# Altium project eTraceConcrete_V1_1.PrjPcb (part 5 of 7)

## Sheet RTC.SchDoc
size A4
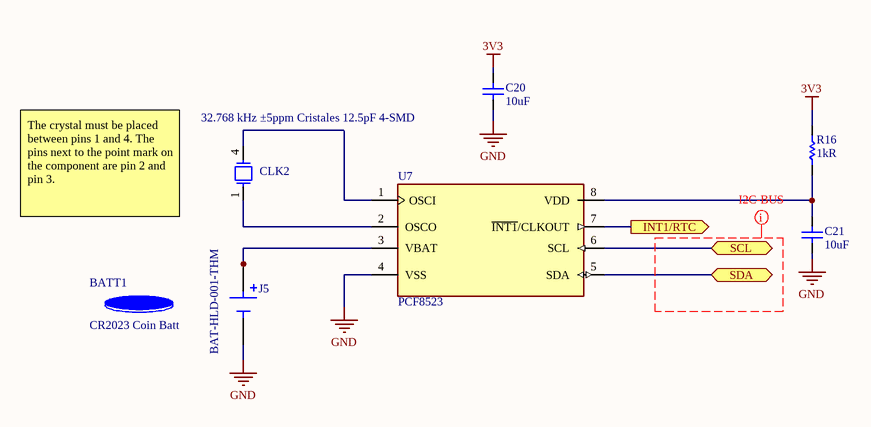
[diagram p6: RTC.SchDoc]

### Parts
BATT1  CR2023 Coin Batt  [CR2032 BATT]
C20  10uF  [Cap 0805 (2012 Metric)]
C21  10uF  [Cap 0805 (2012 Metric)]
CLK2  32.768 kHz ±5ppm Cristales 12.5pF 4-SMD  [Crystal32768]
J5  BAT-HLD-001-THM  [BAT-HLD-001-THM]
R16  1kR  [Res 0805 (2012 Metric)]
U7  PCF8523  [PCF8523]

### Ports
INT1/RTC (out), SCL (bidir), SDA (bidir)

### Nets
3V3: C20.1 R16.1
GND: C20.2 C21.2 J5.N U7.4(VSS)  [project net BS]
SCL: U7.6(SCL) ; port SCL
SDA: U7.5(SDA) ; port SDA
NetC21_1: C21.1 R16.2 U7.8(VDD)
NetCLK2_1: CLK2.1 U7.2(OSCO)
NetCLK2_4: CLK2.4 U7.1(OSCI)
NetJ5_P1: J5.P1(P) J5.P2(P) J5.P3(P) J5.P4(P) U7.3(VBAT)
NetU7_7: U7.7(~{INT1}/CLKOUT) ; port INT1/RTC

### Layout directives
net class I2C-BUS: (no net found under the mark)

### Notes on the sheet
- The crystal must be placed between pins 1 and 4. The pins next to the point mark on the component are pin 2 and pin 3.

### Library data of the parts
BATT1 = CR2023 Coin Batt: CR2032 Series Ø 20 mm 3V 225mAh Non-Rechargeable Lithium Coin Cell Battery; Manufacturer: Panasonic BSG; Number of Cells: 1; Battery Size: 2032; Battery Type: PRIMARY; Supplier 1: Mouser; RoHS: Yes; Category: Passive Components; Mount: External; Weight: 0.1oz; Material: Lithium; Min Operating Temperature: -30°C; Max Operating Temperature: 60°C; Package Quantity: 200; Capacity: 225mAh; Packaging: Tray; Series: CR2032; Chemistry/Technology: Lithium; Voltage Rating: 3V; Battery Chemistry: LITHIUM; Output Voltage: 3V; Voltage: 3V; Voltage Rating (DC): 3V; Diameter: 20mm; Height: 0.13inch; Radiation Hardening: No; Lead Free: Lead Free; RoHS Compliant: Yes; ComponentLink1URL: https://datasheet.ciiva.com/2/crseries-datasheets-merged-2903.pdf?src-supplier=Digi-Key; ComponentLink1Description: https://datasheet.ciiva.com/2/crseries-datasheets-merged-2903.pdf?src-supplier=Digi-Key; ComponentLink2URL: https://datasheet.ciiva.com/2981/aaa4000ce51-2981326.pdf?src-supplier=Avnet; ComponentLink2Description: https://datasheet.ciiva.com/2981/aaa4000ce51-2981326.pdf?src-supplier=Avnet; ComponentLink3URL: https://datasheet.ciiva.com/12070/crseries-datasheets-merged-462862-12070381.pdf?src-supplier=Mouser; ComponentLink3Description: https://datasheet.ciiva.com/12070/crseries-datasheets-merged-462862-12070381.pdf?src-supplier=Mouser; ComponentLink4URL: https://datasheet.ciiva.com/16459/aaa4000ce51-16459422.pdf?src-supplier=Avnet+Asia; ComponentLink4Description: https://datasheet.ciiva.com/16459/aaa4000ce51-16459422.pdf?src-supplier=Avnet+Asia; Pricing 1: 1=0,34000, 10=0,28100, 50=0,28100, 100=0,21700, 1000=0,19500, 10000=0,18100 (USD); Supplier Part Number 1: 658-CR2032; Manufacturer Part Number: CR2032; Link: https://www.digikey.com/es/products/detail/maxell-batteries/MAXELL-CR2032-TS-1/13283094
C20 C21 = Capacitor: CAP CER 10UF 10V X5R 0805; Manufacturer: KEMET; Manufacturer Part Number: C0805C106K8PACTU; Dielectric Material: Ceramic; Tolerance: 10%; Link: https://www.digikey.com/es/products/detail/kemet/C0805C106K8PACTU/1090830?s=N4IgTCBcDaIMIAYAcCCscCMCBsBpJACgIJwAqAqiALoC%2BQA; Supplier 1: Digi-Key; Supplier Part Number 1: 399-4925-1-ND; RoHS: Yes; Category: Ceramic Capacitors; Stock 1: 1166327; Pricing 1: 1=0,15000, 10=0,10600, 50=0,06040, 100=0,05000, 500=0,03508, 1000=0,02904 (USD); Mount: Surface Mount; Case/Package: 0805; Number of Pins: 2; Case Code (Imperial): 0805; Case Code (Metric): 2012; Contact Plating: Tin,Matte; Min Operating Temperature: -55°C; Max Operating Temperature: 85°C; Capacitance: 10uF; Packaging: Tape and Reel; Voltage Rating (DC): 10V; Termination: SMD/SMT; Package Quantity: 1; Voltage Rating: 10V; Voltage: 10V; Series: C; Dielectric: X5R; Construction: Flat; Dissipation Factor: 10%; Length: 2mm; Width: 1.2mm; Height: 1.25mm; Depth: 1.25mm; Thickness: 0.055inch; Radiation Hardening: No; REACH SVHC: No SVHC; RoHS Compliant: Yes; ComponentLink1URL: https://datasheet.ciiva.com/7842/1732709-7842198.pdf?src-supplier=Element14; ComponentLink1Description: https://datasheet.ciiva.com/7842/1732709-7842198.pdf?src-supplier=Element14; ComponentLink2URL: https://datasheet.ciiva.com/7842/40889-7842552.pdf?src-supplier=Element14; ComponentLink2Description: https://datasheet.ciiva.com/7842/40889-7842552.pdf?src-supplier=Element14; ComponentLink3URL: https://datasheet.ciiva.com/22704/1732709-22704859.pdf?src-supplier=Element14; ComponentLink3Description: https://datasheet.ciiva.com/22704/1732709-22704859.pdf?src-supplier=Element14
CLK2 = Crystal32768: 8.0x3.8 - 32.768KHz Quartz Xtal / Plastic, +/-5ppm @25C, 12.5pF; Manufacturer: QST; Manufacturer Part Number: QT2M-32.768KHZF-T; Supplier 1: Future Electronics; RoHS: No; Category: Uncategorized; Supplier Part Number 1: 9124852; Pricing 1: 3000=0,39500, 6000=0,31500 (USD); Link: https://www.digikey.com/es/products/detail/qst/QT2M-32-768KHZF-T/13418370
J5 = BAT-HLD-001-THM: BATTERY RETAINER COIN PC PIN; Manufacturer: Linx; Number of Cells: 1; Supplier 1: Digi-Key; RoHS: Yes; Category: Uncategorized; Stock 1: 22994; Mount: Through Hole,PCB; Package Quantity: 1000; Termination: PC Pin; Series: -; Packaging: Bulk; Lead Free: Lead Free; ComponentLink1URL: https://datasheet.ciiva.com/4/bat-hld-001-thm-4036.pdf?src-supplier=Digi-Key; ComponentLink1Description: https://datasheet.ciiva.com/4/bat-hld-001-thm-4036.pdf?src-supplier=Digi-Key; ComponentLink2URL: https://datasheet.ciiva.com/4642/bat-hld-001-thm20diagram-201675-4642582.pdf?src-supplier=Mouser; ComponentLink2Description: https://datasheet.ciiva.com/4642/bat-hld-001-thm20diagram-201675-4642582.pdf?src-supplier=Mouser; Pricing 1: 1=0,29000, 10=0,27800, 25=0,26600, 100=0,24100, 250=0,23200, 500=0,22200, 1000=0,20300, 2000=0,19000, 5000=0,17600 (USD); Manufacturer Part Number: BAT-HLD-001-THM; Supplier Part Number 1: BAT-HLD-001-THM-ND; Link: https://www.digikey.com/es/products/detail/linx-technologies-inc/BAT-HLD-001-THM/3044009?s=N4IgTCBcDaIEIEEAqBaAEgGQCIoAy4EYUk0BZEAXQF8g
R16 = Resistor: RES 1K OHM 1% 1/4W 0805; Manufacturer: Stackpole Electronics; Manufacturer Part Number: RNCP0805FTD1K00; Power Rating: 250mW; Temperature Coefficient: 100ppm/°C; Link: https://www.digikey.com/es/products/detail/stackpole-electronics-inc/RNCP0805FTD1K00/2240229?s=N4IgTCBcDaIEoDkDCAFADADjQVgGIBUARARgGk00QBdAXyA; Supplier 1: Digi-Key; Supplier Part Number 1: RNCP0805FTD1K00CT-ND; RoHS: Yes; Category: Chip SMD Resistors; Stock 1: 316834; Pricing 1: 1=0,10000, 10=0,07000, 100=0,02830, 1000=0,01272, 2500=0,01104 (USD); Mount: Surface Mount; Case/Package: 0805; Case Code (Metric): 2012; Case Code (Imperial): 0805; Size Code: 0805; Min Operating Temperature: -55°C; Max Operating Temperature: 155°C; Tolerance: 1%; Resistance: 1kR; Packaging: Tape and Reel; Resistor Type: Thin Film; Number of Terminations: 2; Max Power Dissipation: 250mW; Features: Moisture Resistant,Anti-Sulfur; Series: RNCP; Length: 0.079inch; Width: 0.049inch; Height: 0.024inch; Lead Free: Lead Free; RoHS Compliant: Yes; ComponentLink1URL: https://www.seielect.com/catalog/SEI-Packaging.pdf?src-supplier=Digi-Key; ComponentLink1Description: https://www.seielect.com/catalog/SEI-Packaging.pdf?src-supplier=Digi-Key; ComponentLink2URL: https://www.seielect.com/Catalog/SEI-rncp.pdf?src-supplier=Digi-Key; ComponentLink2Description: https://www.seielect.com/Catalog/SEI-rncp.pdf?src-supplier=Digi-Key; ComponentLink3URL: http://www.seielect.com/Catalog/SEI-rncp.pdf?src-supplier=Future+Electronics; ComponentLink3Description: http://www.seielect.com/Catalog/SEI-rncp.pdf?src-supplier=Future+Electronics
U7 = PCF8523: IC RTC CLK/CALENDAR I2C 8-SOIC; Manufacturer: NXP Semiconductors; Manufacturer Part Number: PCF8523T/1,118; Time Format: HH:MM:SS; Logic Function: Clock; Min Supply Voltage: 1.2V; Max Supply Voltage: 5.5V; Supplier 1: Avnet; RoHS: Yes; Category: Interface ICs; Mount: Surface Mount; Case/Package: SO; Number of Pins: 8; Contact Plating: Gold; Min Operating Temperature: -40°C; Max Operating Temperature: 85°C; Packaging: Tape and Reel; Interface: I2C; Package Quantity: 2500; Supply Voltage-Nom: 5.5V; Radiation Hardening: No; RoHS Compliant: Yes; REACH SVHC: No SVHC; Lead Free: Lead Free; Temperature Grade: INDUSTRIAL; ComponentLink1URL: https://datasheet.ciiva.com/1238/pcf8523-1238780.pdf?src-supplier=Digi-Key; ComponentLink1Description: https://datasheet.ciiva.com/1238/pcf8523-1238780.pdf?src-supplier=Digi-Key; ComponentLink2URL: https://datasheet.ciiva.com/1238/pcf8523-1238781.pdf?src-supplier=Digi-Key; ComponentLink2Description: https://datasheet.ciiva.com/1238/pcf8523-1238781.pdf?src-supplier=Digi-Key; ComponentLink3URL: https://datasheet.ciiva.com/1238/pcf8523-1238782.pdf?src-supplier=Digi-Key; ComponentLink3Description: https://datasheet.ciiva.com/1238/pcf8523-1238782.pdf?src-supplier=Digi-Key; ComponentLink4URL: https://datasheet.ciiva.com/15152/getdatasheetpartid-445247-15152839.pdf?src-supplier=Verical; ComponentLink4Description: https://datasheet.ciiva.com/15152/getdatasheetpartid-445247-15152839.pdf?src-supplier=Verical; ComponentLink5URL: https://datasheet.ciiva.com/16286/pcf8523-16286477.pdf?src-supplier=Future+Electronics; ComponentLink5Description: https://datasheet.ciiva.com/16286/pcf8523-16286477.pdf?src-supplier=Future+Electronics; Supplier Part Number 1: 52X6196; Pricing 1: 1=1,58000, 10=1,41000, 25=1,34000, 50=1,22000, 100=1,10000, 250=1,03000 (USD); Link: https://www.digikey.com/es/products/detail/nxp-usa-inc/PCF8523T-1-118/2530422

## Sheet SD.SchDoc
size A4
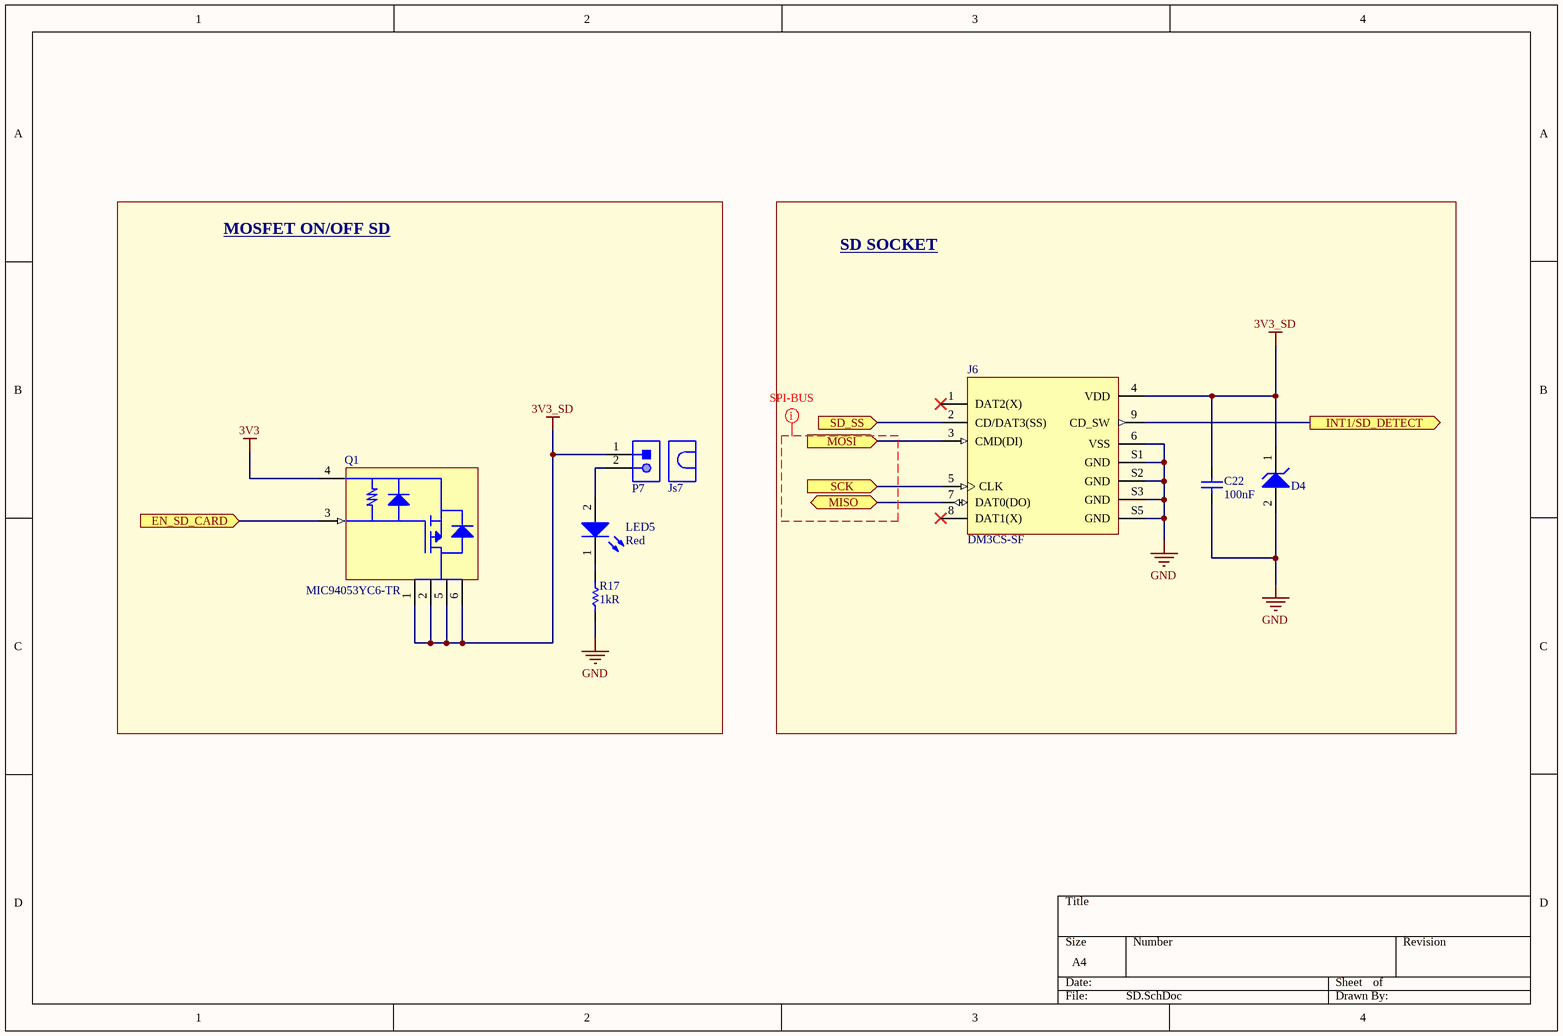
[diagram p7: SD.SchDoc]

### Parts
C22  100nF  [Cap 0805 (2012 Metric)]
D4  Diode  [Diode SOD123]  (value not drawn)
J6  DM3CS-SF  [SDHolder]
Js7  Jumper (2x1)  [Header JMP 2x1]  (value not drawn)
LED5  Red  [LED 0805(2012 METRIC)]
P7  Header 2x1  [Header 2x1]  (value not drawn)
Q1  MIC94053YC6-TR  [SC-70-6]
R17  1kR  [Res 0805 (2012 Metric)]

### Blocks framed on the sheet
MOSFET ON/OFF SD: Js7 LED5 P7 Q1 R17
SD SOCKET: C22 D4 J6

### Ports
EN_SD_CARD (in), INT1/SD_DETECT (out), MISO (bidir), MOSI (in), SCK (in), SD_SS (in)

### Nets
3V3: Q1.4(S)
3V3_SD: C22.1 D4.1(K) J6.4(VDD) P7.1 Q1.1(D) Q1.2(D) Q1.5(D) Q1.6(D)
GND: C22.2 D4.2(A) J6.6(VSS) J6.S1(GND) J6.S2(GND) J6.S3(GND) J6.S5(GND) R17.2  [project net BS]
EN_SD_CARD: Q1.3(G) ; port EN_SD_CARD
INT1/SD_DETECT: J6.9(CD_SW) ; port INT1/SD_DETECT
MISO: J6.7(DAT0(DO)) ; port MISO
MOSI: J6.3(CMD(DI)) ; port MOSI
SCK: J6.5(CLK) ; port SCK
SD_SS: J6.2(CD/DAT3(SS)) ; port SD_SS
NetLED5_1: LED5.1(K) R17.1
NetLED5_2: LED5.2(A) P7.2

Not connected (* = marked no-connect by the designer): J6 1(DAT2(X))* 8(DAT1(X))*

### Layout directives
net class SPI-BUS: (no net found under the mark)

### Library data of the parts
C22 = Capacitor: YAGEO (PHYCOMP)         CC0805ZRY5V9BB104             SMD Multilayer Ceramic Capacitor, 0805 [2012 Metric], 0.1 uF, 50 V, +80%, -20%, Y5V, CC Series; Tolerance: 80%; Voltage Rating: 50V; Link: https://www.digikey.com/es/products/detail/yageo/CC0805ZRY5V9BB104/2103099?s=N4IgTCBcDaIMJwAwA5EFYBaAlAmmgagJwBCxAjIgCwgC6AvkA; Supplier 1: Digi-Key; Supplier Part Number 1: 311-1361-1-ND; Manufacturer: Yageo; Manufacturer Part Number: CC0805ZRY5V9BB104; RoHS: Yes; Category: Ceramic Capacitors; Stock 1: 92689; Pricing 1: 1=0,10000, 10=0,07000, 50=0,03800, 100=0,03100, 500=0,02214, 1000=0,01739 (USD); Mount: Surface Mount; Case/Package: 0805; Number of Pins: 2; Case Code (Metric): 2012; Case Code (Imperial): 0805; Material: Ceramic; Dielectric Material: Ceramic; Min Operating Temperature: -30°C; Max Operating Temperature: 85°C; Capacitance: 100nF; Dielectric: Y5V; Package Quantity: 1; Packaging: Tape and Reel; Voltage Rating (DC): 50V; Termination: SMD/SMT; Resistor Type: Ceramic; Series: CC; Construction: Flat; Length: 2mm; Width: 0.049inch; Height: 0.6mm; Depth: 1.25mm; Thickness: 0.024inch; Radiation Hardening: No; REACH SVHC: No SVHC; Lead Free: Lead Free; Halogen Free: Halogen Free; RoHS Compliant: Yes; ComponentLink1URL: https://datasheet.ciiva.com/144/mlccorderingcode-144209.pdf?src-supplier=Digi-Key; ComponentLink1Description: https://datasheet.ciiva.com/144/mlccorderingcode-144209.pdf?src-supplier=Digi-Key; ComponentLink2URL: https://datasheet.ciiva.com/144/mlccorderingcode-144210.pdf?src-supplier=Digi-Key; ComponentLink2Description: https://datasheet.ciiva.com/144/mlccorderingcode-144210.pdf?src-supplier=Digi-Key; ComponentLink3URL: https://datasheet.ciiva.com/144/mlccorderingcode-144211.pdf?src-supplier=Digi-Key; ComponentLink3Description: https://datasheet.ciiva.com/144/mlccorderingcode-144211.pdf?src-supplier=Digi-Key; ComponentLink4URL: https://datasheet.ciiva.com/11465/upy-gphc-y5v-6-3v-to-50v-5-11465865.pdf?src-supplier=Avnet; ComponentLink4Description: https://datasheet.ciiva.com/11465/upy-gphc-y5v-6-3v-to-50v-5-11465865.pdf?src-supplier=Avnet; ComponentLink5URL: https://datasheet.ciiva.com/13389/upy-gp-np0-16v-to-50v-8-13389351.pdf?src-supplier=Mouser; ComponentLink5Description: https://datasheet.ciiva.com/13389/upy-gp-np0-16v-to-50v-8-13389351.pdf?src-supplier=Mouser; ComponentLink6URL: https://datasheet.ciiva.com/17435/upy-gphc-y5v-6-3v-to-50v-5-17435053.pdf?src-supplier=Avnet+Europe; ComponentLink6Description: https://datasheet.ciiva.com/17435/upy-gphc-y5v-6-3v-to-50v-5-17435053.pdf?src-supplier=Avnet+Europe; ComponentLink7URL: https://datasheet.ciiva.com/15189/getdatasheetpartid-55882-15189238.pdf?src-supplier=Verical; ComponentLink7Description: https://datasheet.ciiva.com/15189/getdatasheetpartid-55882-15189238.pdf?src-supplier=Verical; ComponentLink8URL: https://datasheet.ciiva.com/16747/upy-gphc-y5v-6-3v-to-50v-5-revised-16747323.pdf?src-supplier=Future+Electronics; ComponentLink8Description: https://datasheet.ciiva.com/16747/upy-gphc-y5v-6-3v-to-50v-5-revised-16747323.pdf?src-supplier=Future+Electronics; ComponentLink9URL: https://datasheet.ciiva.com/28450/1132289-28450870.pdf?src-supplier=Element14; ComponentLink9Description: https://datasheet.ciiva.com/28450/1132289-28450870.pdf?src-supplier=Element14; ComponentLink10URL: https://datasheet.ciiva.com/29241/445331-da-01-en-kerko-chip-0805-y5v0-1uf-20-80proz50vg-29241946.pdf?src-supplier=Conrad; ComponentLink10Description: https://datasheet.ciiva.com/29241/445331-da-01-en-kerko-chip-0805-y5v0-1uf-20-80proz50vg-29241946.pdf?src-supplier=Conrad
D4 = Diode: DIODE GEN PURP 75V 150MA 0603; Manufacturer: Taiwan Semiconductor; Manufacturer Part Number: TS4148CRZG; Forward Voltage: 1.25V; Peak Non-Repetitive Surge Current: 800mA; Element Configuration: Single; Max Forward Surge Current (Ifsm): 2A; Reverse Recovery Time: 4ns; Link: https://www.digikey.com/es/products/detail/taiwan-semiconductor-corporation/TS4148C-RZG/7359811?s=N4IgTCBcDaICoGUAsBGJAOAwgJQFoHEQBdAXyA; Supplier 1: Digi-Key; Supplier Part Number 1: TS4148CRZGCT-ND; RoHS: Yes; Category: Uncategorized; Stock 1: 278970; Pricing 1: 1=0,39000, 10=0,29400, 100=0,16640, 500=0,11022, 1000=0,08450, 2000=0,07348 (USD); Mount: Surface Mount; Case/Package: SMD/SMT; Number of Pins: 2; Min Operating Temperature: -55°C; Max Operating Temperature: 150°C; Packaging: Tape and Reel; Package Quantity: 5000; Max Repetitive Reverse Voltage (Vrrm): 75V; Radiation Hardening: No; RoHS Compliant: Yes; ComponentLink1URL: https://datasheet.ciiva.com/18168/getdatasheetpartid-464901-18168310.pdf?src-supplier=Verical; ComponentLink1Description: https://datasheet.ciiva.com/18168/getdatasheetpartid-464901-18168310.pdf?src-supplier=Verical
J6 = SDHolder: 10 (8 + 2) Position Card Connector Secure Digital - microSD™ Surface Mount, Right Angle Gold; Manufacturer: Hirose; Max Current Rating: 500mA; Number of Contacts: 8; Connector Type: Connector,Socket; Insulation Resistance: 1GR; Contact Resistance: 100mR; Voltage Rating (AC): 125V; Gender: Female; Pitch: 1.1mm; Link: https://www.digikey.com/product-detail/en/hirose-electric-co-ltd/DM3CS-SF/HR1972CT-ND/2602740; Supplier 1: Digi-Key; Supplier Part Number 1: HR1972DKR-ND; Manufacturer Part Number: DM3CS-SF; RoHS: Yes; Category: Memory Connectors; Stock 1: 6683; Pricing 1: 1=1,51000, 10=1,37400, 25=1,29040, 50=1,23420, 100=1,17810, 250=1,06592, 500=0,98176 (USD); Mount: Surface Mount; Contact Material: Gold,Copper Alloy,Copper; Contact Plating: Gold; Housing Material: Polymer; Min Operating Temperature: -25°C; Max Operating Temperature: 85°C; Orientation: Right Angle; Number of Rows: 1; Termination: Solder; Package Quantity: 1; Packaging: Tape and Reel; Number of Positions: 8; Current Rating: 500mA; Length: 14.1mm; Depth: 1.83mm; Width: 13.8mm; Radiation Hardening: No; Flammability Rating: UL94 V-0; Lead Free: Lead Free; REACH SVHC: Unknown; ComponentLink1URL: https://datasheet.ciiva.com/683/e60900232-683360.pdf?src-supplier=Digi-Key; ComponentLink1Description: https://datasheet.ciiva.com/683/e60900232-683360.pdf?src-supplier=Digi-Key; ComponentLink2URL: https://datasheet.ciiva.com/4581/e60900232-38395-4581034.pdf?src-supplier=Mouser; ComponentLink2Description: https://datasheet.ciiva.com/4581/e60900232-38395-4581034.pdf?src-supplier=Mouser; ComponentLink3URL: https://datasheet.ciiva.com/16434/e60900232-16434058.pdf?src-supplier=Future+Electronics; ComponentLink3Description: https://datasheet.ciiva.com/16434/e60900232-16434058.pdf?src-supplier=Future+Electronics; ComponentLink4URL: https://datasheet.ciiva.com/683/e60900232-683359.pdf?src-supplier=Digi-Key; ComponentLink4Description: https://datasheet.ciiva.com/683/e60900232-683359.pdf?src-supplier=Digi-Key; ComponentLink5URL: https://datasheet.ciiva.com/683/e60900232-683361.pdf?src-supplier=Digi-Key; ComponentLink5Description: https://datasheet.ciiva.com/683/e60900232-683361.pdf?src-supplier=Digi-Key; ComponentLink6URL: https://datasheet.ciiva.com/7651/1465328-7651895.pdf?src-supplier=Element14; ComponentLink6Description: https://datasheet.ciiva.com/7651/1465328-7651895.pdf?src-supplier=Element14; ComponentLink7URL: https://datasheet.ciiva.com/3122/e60900232-3122536.pdf?src-supplier=Avnet; ComponentLink7Description: https://datasheet.ciiva.com/3122/e60900232-3122536.pdf?src-supplier=Avnet
Js7 = Jumper (2x1): 2 (1 x 2) Position Shunt Connector Black Open Top 0.100" (2.54mm) Gold; Manufacturer: Sullins; Manufacturer Part Number: QPC02SXGN-RC; Number of Positions: 2; Pitch: 0.1inch; Link: https://www.digikey.com/product-detail/en/sullins-connector-solutions/QPC02SXGN-RC/S9337-ND/2618262; Supplier 1: Digi-Key; Supplier Part Number 1: S9337-ND; RoHS: Yes; Category: Connectors; Stock 1: 529611; Pricing 1: 1=0,10000, 10=0,05900, 25=0,04400, 50=0,03780, 100=0,03650, 250=0,03152, 500=0,03024, 1000=0,02646, 2500=0,02394 (USD); Case/Package: 100; Contact Plating: Gold; Package Quantity: 2000; Packaging: Bulk; Height: 0.235inch; Lead Free: Lead Free; ComponentLink1URL: https://datasheet.ciiva.com/767/284-sxgn-11510-767869.pdf?src-supplier=Digi-Key; ComponentLink1Description: https://datasheet.ciiva.com/767/284-sxgn-11510-767869.pdf?src-supplier=Digi-Key
LED5 = LED: SMD LED red 2.4 V 0805, 150080RS75000, Würth Elektronik; Manufacturer: Wurth Electronics; Luminous Intensity: 150mcd; Viewing Angle: 140°; Forward Voltage: 2V; Wavelength: 625nm; Lens Style: Clear,Rectangular; Forward Current: 30mA; Test Current: 20mA; Link: https://www.digikey.com/es/products/detail/w%C3%BCrth-elektronik/150080RS75000/4489918?s=N4IgTCBcDaIIwFYAMSAcSBKBlA7MlIAugL5A; Supplier 1: Digi-Key; Supplier Part Number 1: 732-4984-1-ND; Manufacturer Part Number: 150080RS75000; RoHS: Yes; Category: LEDs; Stock 1: 57843; Pricing 1: 1=0,18000, 50=0,16500, 100=0,14200, 500=0,12300 (USD); Mount: Surface Mount; Case/Package: 0805; Color: Red; Case Code (Metric): 2012; Case Code (Imperial): 0805; Min Operating Temperature: -40°C; Max Operating Temperature: 85°C; Package Quantity: 4000; Packaging: Tape and Reel; Dominant Wavelength: 625nm; Length: 2mm; Width: 1.25mm; Height: 0.7mm; REACH SVHC: Unknown; RoHS Compliant: Yes; ComponentLink1URL: https://datasheet.ciiva.com/22656/150080rs75000-22656961.pdf?src-supplier=Element14; ComponentLink1Description: https://datasheet.ciiva.com/22656/150080rs75000-22656961.pdf?src-supplier=Element14; ComponentLink2URL: https://datasheet.ciiva.com/29279/759435-da-01-en-chipled-0805-w-kl-rot-150080rs75000-29279032.pdf?src-supplier=Conrad; ComponentLink2Description: https://datasheet.ciiva.com/29279/759435-da-01-en-chipled-0805-w-kl-rot-150080rs75000-29279032.pdf?src-supplier=Conrad
P7 = Header 2x1: Connector Header Through Hole 2 position 0.100" (2.54mm); Manufacturer: Amphenol FCI; Manufacturer Part Number: 68001-402HLF; Number of Contacts: 2; Connector Type: Male Pin; Insulation Resistance: 5GR; Max Voltage Rating (AC): 1.5kV; Gender: Male; Current Rating: 3A; Contact Post Length: 3.05mm; Link: https://www.digikey.com/product-detail/en/amphenol-icc-fci/68001-402HLF/609-3507-ND/1530472; Supplier 1: Digi-Key; Supplier Part Number 1: 609-3507-ND; RoHS: Yes; Category: Headers and Wire Housings; Stock 1: 5598; Pricing 1: 1=0,12000, 10=0,11600, 100=0,07160, 500=0,05928, 1000=0,05187, 5000=0,04446, 10000=0,04323 (USD); Mount: Through Hole; Contact Plating: Tin; Housing Material: Thermoplastic; Housing Color: Black; Color: Black; Contact Material: Bronze; Min Operating Temperature: -65°C; Max Operating Temperature: 125°C; Termination: Solder; Number of Rows: 1; Number of Positions: 2; Orientation: Straight; Package Quantity: 100; Packaging: Bulk; Contact Gender: Male; Voltage Rating: 1.5kV; Length: 5.08mm; Pitch: 2.54mm; Contact Mating Length: 0.23inch; Depth: 2.41mm; Radiation Hardening: No; REACH SVHC: No SVHC; Flammability Rating: UL94 V-0; Lead Free: Lead Free; ComponentLink1URL: https://datasheet.ciiva.com/724/68000-724389.pdf?src-supplier=Digi-Key; ComponentLink1Description: https://datasheet.ciiva.com/724/68000-724389.pdf?src-supplier=Digi-Key; ComponentLink2URL: https://datasheet.ciiva.com/16726/68000-16726185.pdf?src-supplier=Avnet+Europe; ComponentLink2Description: https://datasheet.ciiva.com/16726/68000-16726185.pdf?src-supplier=Avnet+Europe; ComponentLink3URL: https://datasheet.ciiva.com/10149/68000-10149338.pdf?src-supplier=Avnet; ComponentLink3Description: https://datasheet.ciiva.com/10149/68000-10149338.pdf?src-supplier=Avnet; ComponentLink4URL: https://datasheet.ciiva.com/46385/1748756-46385306.pdf?src-supplier=Element14; ComponentLink4Description: https://datasheet.ciiva.com/46385/1748756-46385306.pdf?src-supplier=Element14
Q1 = TransistorMosfet(Load): P-Channel 6V 2A (Ta) 270mW (Ta) Surface Mount SC-70-6; Manufacturer: Microchip; Link: https://www.digikey.com/product-detail/en/microchip-technology/MIC94053YC6-TR/576-2939-1-ND/1822099; Supplier 1: Digi-Key; Supplier Part Number 1: 576-2939-1-ND; Manufacturer Part Number: MIC94053YC6-TR; RoHS: Yes; Category: MOSFETs; Stock 1: 3005; Pricing 1: 1=0,58000, 25=0,48000, 100=0,46250 (USD); ComponentLink1URL: https://datasheet.ciiva.com/6379/mic94052-53-6379193.pdf?src-supplier=Digi-Key; ComponentLink1Description: https://datasheet.ciiva.com/6379/mic94052-53-6379193.pdf?src-supplier=Digi-Key; ComponentLink2URL: https://datasheet.ciiva.com/6379/mic94052-53-6379189.pdf?src-supplier=Digi-Key; ComponentLink2Description: https://datasheet.ciiva.com/6379/mic94052-53-6379189.pdf?src-supplier=Digi-Key; ComponentLink3URL: https://datasheet.ciiva.com/46408/264781-46408581.pdf?src-supplier=Element14; ComponentLink3Description: https://datasheet.ciiva.com/46408/264781-46408581.pdf?src-supplier=Element14; ComponentLink4URL: https://datasheet.ciiva.com/15200/getdatasheetpartid-111629-15200795.pdf?src-supplier=Verical; ComponentLink4Description: https://datasheet.ciiva.com/15200/getdatasheetpartid-111629-15200795.pdf?src-supplier=Verical
R17 = Resistor: as R16 on sheet RTC; Link: https://www.digikey.com/es/products/detail/stackpole-electronics-inc/RNCP0805FTD1K00/2240229?s=N4IgTCBcDaIEoDkDCAFADADjQVgGIBUARARgGk00QBdAXyA; Supplier 1: Digi-Key; Supplier Part Number 1: RNCP0805FTD1K00CT-ND; RoHS: Yes; Category: Chip SMD Resistors; Stock 1: 316834; Pricing 1: 1=0,10000, 10=0,07000, 100=0,02830, 1000=0,01272, 2500=0,01104 (USD); Mount: Surface Mount; Case/Package: 0805; Case Code (Metric): 2012; Case Code (Imperial): 0805; Size Code: 0805; Min Operating Temperature: -55°C; Max Operating Temperature: 155°C; Tolerance: 1%; Resistance: 1kR; Packaging: Tape and Reel; Resistor Type: Thin Film; Number of Terminations: 2; Max Power Dissipation: 250mW; Features: Moisture Resistant,Anti-Sulfur; Series: RNCP; Length: 0.079inch; Width: 0.049inch; Height: 0.024inch; Lead Free: Lead Free; RoHS Compliant: Yes; ComponentLink1URL: https://www.seielect.com/catalog/SEI-Packaging.pdf?src-supplier=Digi-Key; ComponentLink1Description: https://www.seielect.com/catalog/SEI-Packaging.pdf?src-supplier=Digi-Key; ComponentLink2URL: https://www.seielect.com/Catalog/SEI-rncp.pdf?src-supplier=Digi-Key; ComponentLink2Description: https://www.seielect.com/Catalog/SEI-rncp.pdf?src-supplier=Digi-Key; ComponentLink3URL: http://www.seielect.com/Catalog/SEI-rncp.pdf?src-supplier=Future+Electronics; ComponentLink3Description: http://www.seielect.com/Catalog/SEI-rncp.pdf?src-supplier=Future+Electronics

## Sheet LoRaWAN.SchDoc
size A3
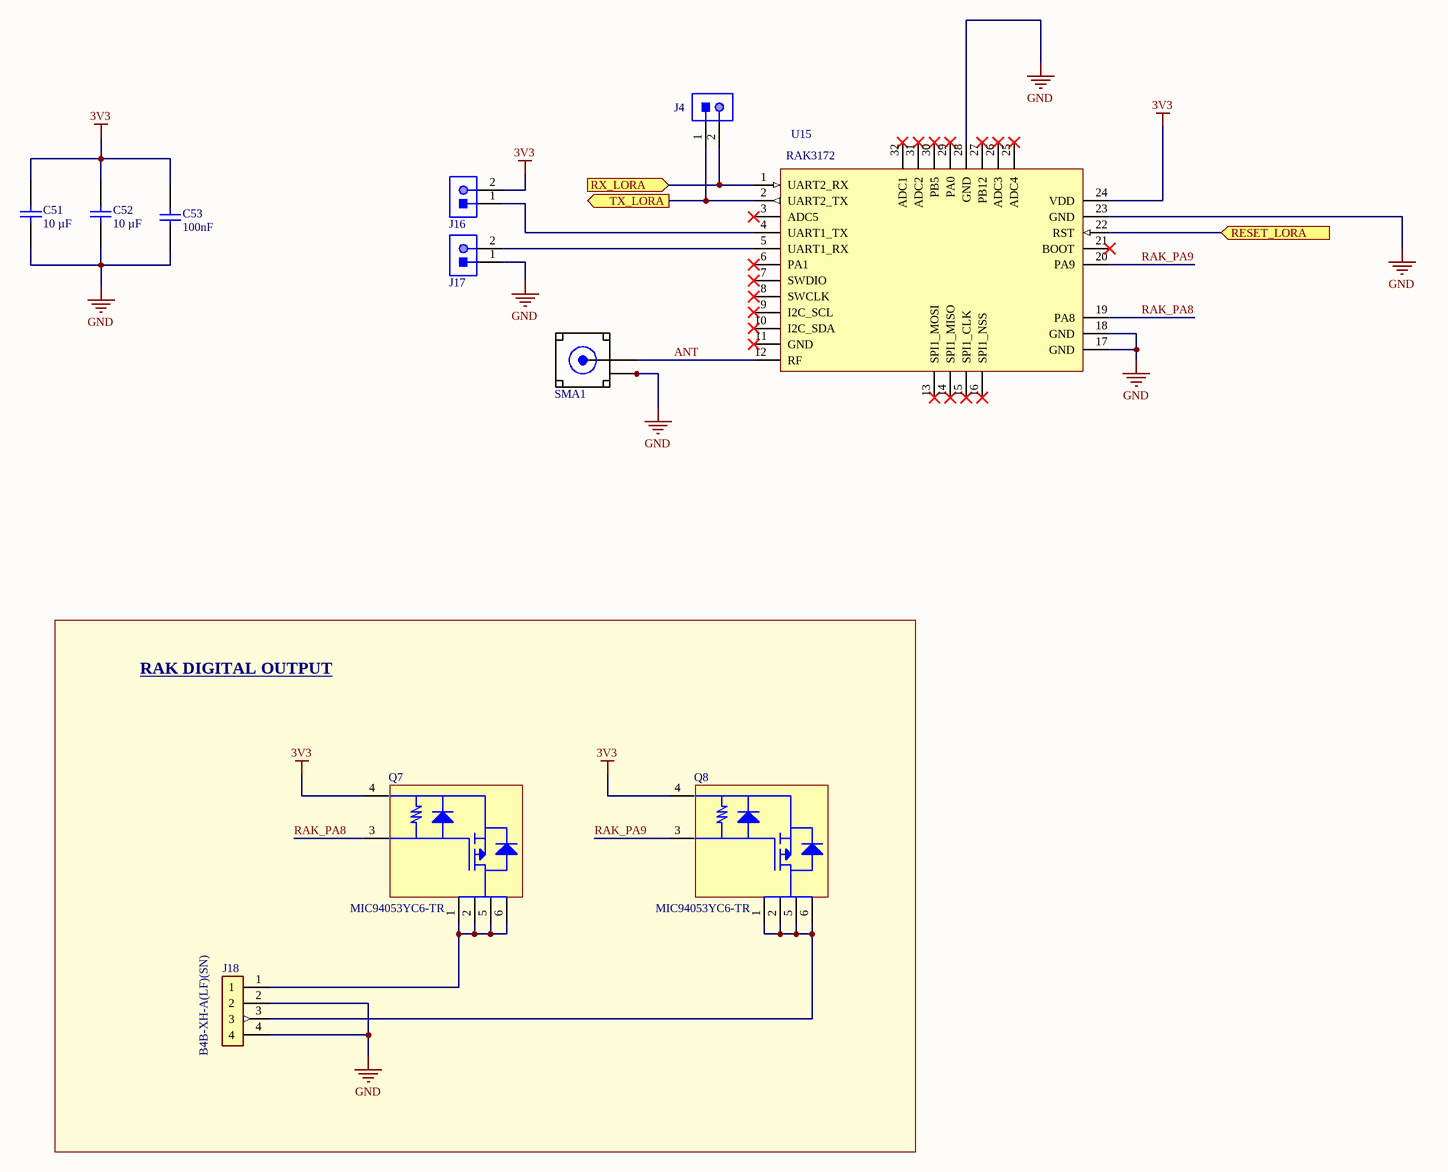
[diagram p8: LoRaWAN.SchDoc]

### Parts
C51  10 µF  [Cap 0805 (2012 Metric)]
C52  10 µF  [Cap 0805 (2012 Metric)]
C53  100nF  [Cap 0805 (2012 Metric)]
J4  Header 2x1  [Header 2x1]  (value not drawn)
J16  Header 2x1  [Header 2x1]  (value not drawn)
J17  Header 2x1  [Header 2x1]  (value not drawn)
J18  B4B-XH-A(LF)(SN)  [B4B-XH-A(LF)(SN)]
Q7  MIC94053YC6-TR  [SC-70-6]
Q8  MIC94053YC6-TR  [SC-70-6]
SMA1  https://www.digikey.com/products/en?keywords=5-1814400-1  [5-1814400-1+ant]  (value not drawn)
U15  RAK3172  [RAK3172]

### Blocks framed on the sheet
RAK DIGITAL OUTPUT: J18 Q7 Q8

### Ports
RESET_LORA (in), RX_LORA (in), TX_LORA (out)

### Nets
3V3: C51.1 C52.1 C53.1 J16.2 Q7.4(S) Q8.4(S) U15.24(VDD)
GND: C51.2 C52.2 C53.2 J17.1 J18.2 J18.4 SMA1.1(GND) SMA1.2(GND) SMA1.3(GND) SMA1.4(GND) U15.17(GND) U15.18(GND) U15.23(GND) U15.28(GND)  [project net BS]
ANT: SMA1.5(SIGNAL) U15.12(RF)
RAK_PA8: Q7.3(G) U15.19(PA8)
RAK_PA9: Q8.3(G) U15.20(PA9)
RESET_LORA: U15.22(RST) ; port RESET_LORA
RX_LORA: J4.2 U15.1(UART2_RX) ; port RX_LORA
RXD1: J4.1 U15.2(UART2_TX) ; port TX_LORA
NetJ16_1: J16.1 U15.4(UART1_TX)
NetJ17_2: J17.2 U15.5(UART1_RX)
NetJ18_1: J18.1 Q7.1(D) Q7.2(D) Q7.5(D) Q7.6(D)
NetJ18_3: J18.3 Q8.1(D) Q8.2(D) Q8.5(D) Q8.6(D)

Not connected (* = marked no-connect by the designer): U15 3(ADC5)* 6(PA1)* 7(SWDIO)* 8(SWCLK)* 9(I2C_SCL)* 10(I2C_SDA)* 11(GND)* 13(SPI1_MOSI)* 14(SPI1_MISO)* 15(SPI1_CLK)* 16(SPI1_NSS)* 21(BOOT)* 25(ADC4)* 26(ADC3)* 27(PB12)* 29(PA0)* 30(PB5)* 31(ADC2)* 32(ADC1)*

### Library data of the parts
C51 C52 = Capacitor: 10 µF ±10% 10V Ceramic Capacitor X5R 0805 (2012 Metric); Manufacturer: Cal-Chip Electronics; Manufacturer Part Number: GMC21X5R106K10NT; Link: https://www.digikey.com/en/products/detail/cal-chip-electronics-inc/GMC21X5R106K10NT/13970195; Supplier 1: Digi-Key; Supplier Part Number 1: 66925-507LF-ND; RoHS: Yes; Capacitance: 10 µF
C53 = Capacitor: Cap Ceramic 0.1uF 50V X7R 10% Pad SMD 0805 125C Automotive T/R; Manufacturer: Samsung; Manufacturer Part Number: CL21B104KBC5PNL; Link: https://www.digikey.com/es/products/detail/samsung-electro-mechanics/CL21B104KBC5PNL/7320505?s=N4IgTCBcDaIMIBkwEYBCyAMAWA0quArAAoByCIAugL5A; Supplier 1: Digi-Key; Supplier Part Number 1: 1276-7000-1-ND; RoHS: Yes; Category: Ceramic Capacitors; Stock 1: 163447; Pricing 1: 1=0,26000, 10=0,18000, 50=0,10820, 100=0,09140, 500=0,06254, 1000=0,05533, 2500=0,05292, 5000=0,04811 (USD); Mount: Surface Mount; Case/Package: 0805; Min Operating Temperature: -55°C; Max Operating Temperature: 125°C; Capacitance: 100nF; Tolerance: 10%; Dielectric: X7R; Packaging: Tape and Reel; Voltage: 50V; Series: CL; Length: 2mm; Height: 0.85mm; Depth: 1.25mm; Radiation Hardening: No; ComponentLink1URL: https://datasheet.ciiva.com/15195/getdatasheetpartid-359581-15195873.pdf?src-supplier=Verical; ComponentLink1Description: https://datasheet.ciiva.com/15195/getdatasheetpartid-359581-15195873.pdf?src-supplier=Verical
J18 = B4B-XH-A(LF)(SN): JST (JAPAN SOLDERLESS TERMINALS) - B4B-XH-A (LF)(SN) - Wire-To-Board Connector, Vertical, 2.5 mm, 4 Contacts, Header, XH Series, Through Hole, 1 Rows; Insulation Resistance: 1GR; Current Rating: 3A; Contact Resistance: 20mR; Gender: Male; Number of Positions: 4; Max Voltage Rating (AC): 250V; Connector Type: Male Pin; Pitch: 2.5mm; Wire/Cable Gauge: 22AWG; Supplier 1: Arrow Electronics; Manufacturer: JST; RoHS: Yes; Category: FFC / FPC; Mount: Through Hole; Contact Plating: Tin,Copper,Lead; Contact Material: Brass; Color: Natural; Housing Material: Polyamide; Housing Color: White; Material: Polyamide; Min Operating Temperature: -25°C; Max Operating Temperature: 85°C; Termination: Press-Fit; Series: XH; Number of Rows: 1; Packaging: Bulk; Orientation: Straight; Max Current Rating: 3A; Package Quantity: 500; Number of Contacts: 4; Contact Type: Male Pin; Voltage Rating (AC): 250V; Voltage Rating: 250V; Max Voltage Rating (DC): 250V; Length: 12.4mm; Depth: 5.75mm; Lead Pitch: 2.5mm; REACH SVHC: No SVHC; Lead Free: Lead Free; ComponentLink1URL: https://datasheet.ciiva.com/26894/getdatasheetpartid-455616-26894787.pdf?src-supplier=Verical; ComponentLink1Description: https://datasheet.ciiva.com/26894/getdatasheetpartid-455616-26894787.pdf?src-supplier=Verical; ComponentLink2URL: https://datasheet.ciiva.com/16203/b4b-xh-alfsn-16203642.pdf?src-supplier=Future+Electronics; ComponentLink2Description: https://datasheet.ciiva.com/16203/b4b-xh-alfsn-16203642.pdf?src-supplier=Future+Electronics; ComponentLink3URL: https://datasheet.ciiva.com/26924/getdatasheetpartid-640571-26924035.pdf?src-supplier=Verical; ComponentLink3Description: https://datasheet.ciiva.com/26924/getdatasheetpartid-640571-26924035.pdf?src-supplier=Verical; ComponentLink4URL: https://datasheet.ciiva.com/726/exh-726404.pdf?src-supplier=Digi-Key; ComponentLink4Description: https://datasheet.ciiva.com/726/exh-726404.pdf?src-supplier=Digi-Key; Manufacturer Part Number: B4B-XH-A(LF)(SN); Supplier Part Number 1: B4B-XH-A (LF)(SN); Link: https://www.digikey.com/es/products/detail/jst-sales-america-inc/B4B-XH-A-LF-SN/1651047?s=N4IgTCBcDaIEIBY4FoAaAJZBBAFAGQDEBKHAZQDkiQBdAXyA
Q7 Q8 = TransistorMosfet(Load): as Q1 on sheet SD; Link: https://www.digikey.com/product-detail/en/microchip-technology/MIC94053YC6-TR/576-2939-1-ND/1822099; Supplier 1: Digi-Key; Supplier Part Number 1: 576-2939-1-ND; Manufacturer Part Number: MIC94053YC6-TR; RoHS: Yes; Category: MOSFETs; Stock 1: 3005; Pricing 1: 1=0,58000, 25=0,48000, 100=0,46250 (USD); ComponentLink1URL: https://datasheet.ciiva.com/6379/mic94052-53-6379193.pdf?src-supplier=Digi-Key; ComponentLink1Description: https://datasheet.ciiva.com/6379/mic94052-53-6379193.pdf?src-supplier=Digi-Key; ComponentLink2URL: https://datasheet.ciiva.com/6379/mic94052-53-6379189.pdf?src-supplier=Digi-Key; ComponentLink2Description: https://datasheet.ciiva.com/6379/mic94052-53-6379189.pdf?src-supplier=Digi-Key; ComponentLink3URL: https://datasheet.ciiva.com/46408/264781-46408581.pdf?src-supplier=Element14; ComponentLink3Description: https://datasheet.ciiva.com/46408/264781-46408581.pdf?src-supplier=Element14; ComponentLink4URL: https://datasheet.ciiva.com/15200/getdatasheetpartid-111629-15200795.pdf?src-supplier=Verical; ComponentLink4Description: https://datasheet.ciiva.com/15200/getdatasheetpartid-111629-15200795.pdf?src-supplier=Verical
SMA1 = 5-1814400-1: CONN SMA JACK R/A 50 OHM PCB; Manufacturer: AMP - TE CONNECTIVITY; Supplier 1: Digi-Key; Manufacturer Part Number: 5-1814400-1; Stock 1: 16359; Pricing 1: 1=2,61000, 10=2,50400, 25=2,29560, 50=2,19120, 100=2,08690, 250=1,82604, 500=1,77386, 1000=1,51300, 2500=1,40866 (USD); RoHS: No; ComponentLink1URL: http://www.farnell.com/datasheets/1803168.pdf?src-supplier=Farnell; ComponentLink1Description: http://www.farnell.com/datasheets/1803168.pdf?src-supplier=Farnell; ComponentLink2URL: https://www.te.com/commerce/DocumentDelivery/DDEController?Action=srchrtrv&DocNm=1814400&DocType=Customer+Drawing&DocLang=English&src-supplier=Digi-Key; ComponentLink2Description: https://www.te.com/commerce/DocumentDelivery/DDEController?Action=srchrtrv&DocNm=1814400&DocType=Customer+Drawing&DocLang=English&src-supplier=Digi-Key; ComponentLink3URL: http://www.farnell.com/datasheets/1803168.pdf?src-supplier=Newark; ComponentLink3Description: http://www.farnell.com/datasheets/1803168.pdf?src-supplier=Newark; Supplier Part Number 1: A97593-ND; Link: https://www.digikey.com/es/products/detail/te-connectivity-amp-connectors/5-1814400-1/1755981?s=N4IgTCBcDaIKwFoCMAOJAWdAGLyQF0BfIA
U15 = RAK3172: RAK3172 WisDuo LPWAN Module; Manufacturer: RAK; Manufacturer Part Number: RAK3172; Link: https://store.rakwireless.com/products/wisduo-lpwan-module-rak3172?variant=40014759395526